# Altium project weather_station.PrjPcb
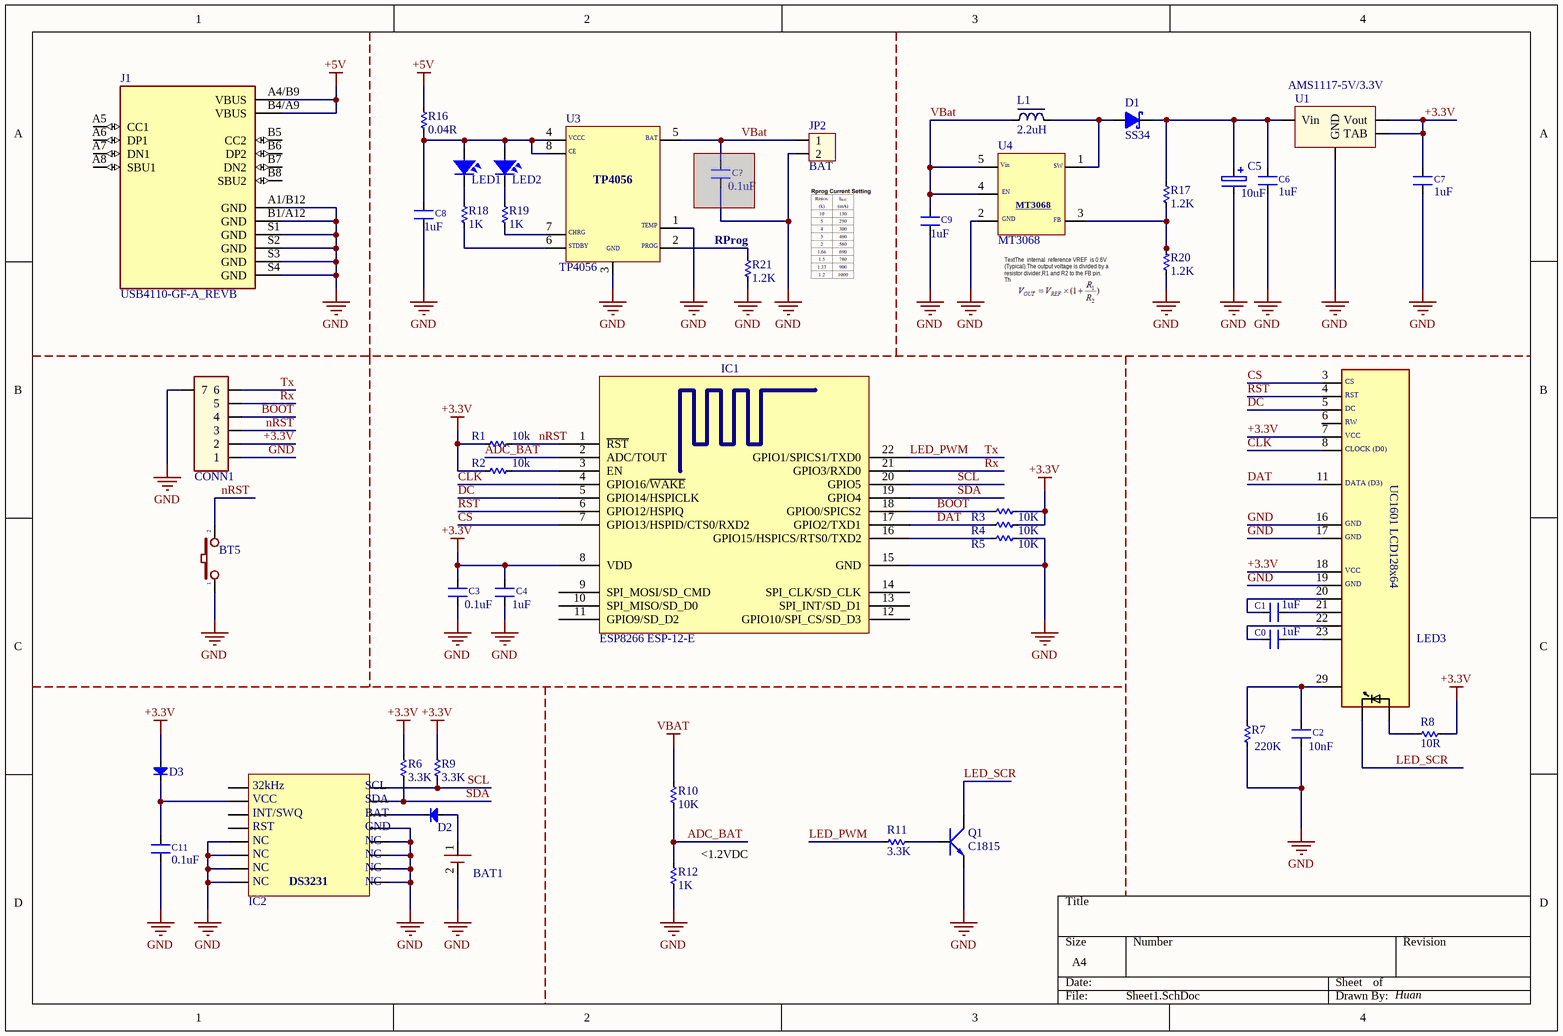
[diagram p0: Sheet1.SchDoc]
1 sheet, 48 parts. Net scope: global (net labels, ports and power ports of the same name join across sheets).
Board files: PCB1.PcbDoc, Rev1.1.PcbDoc

## Sheet Sheet1.SchDoc
size A4; SheetNumber: 1; SheetTotal: 1

### Parts
BAT1  CR2032  [CR2032_SMD]  (value not drawn)
BT5  BUTTON1  [SW-SMD - 3x4x2]  (value not drawn)
C0  1uF  [CN-SMD-0805]
C1  1uF  [CN-SMD-0805]
C2  10nF  [CN-SMD-0805]
C3  0.1uF  [CN-SMD-0805]
C4  1uF  [CN-SMD-0805]
C5  10uF  [cap_A_SMD 10uF/16V]
C6  1uF  [CN-SMD-0805]
C7  1uF  [CN-SMD-0805]
C8  1uF  [CN-SMD-0805]
C9  1uF  [CN-SMD-0805]
C11  0.1uF  [CN-SMD-0805]
C?  0.1uF  [CN-SMD-0805]  (masked out: inside a compile mask, not in the netlist)
CONN1  CONNECTOR 6P  [JST-PH2.0_6P]  (value not drawn)
D1  SS34  [DO-214AC(SMA)]
D2  (no value)  [SOD123]
D3  (no value)  [SOD123]
IC1  ESP8266 ESP-12-E  [ESP8266 ESP-12-E]
IC2  DS3231  [SO-16]  (value not drawn)
J1  USB4110-GF-A_REVB  [GCT_USB4105-GF-A]
JP2  BAT  [CON2]
L1  2.2uH  [L-SMD-06030-7.4x6.6X3]
LED1  GREEN  [SM-LED-0805-Green]  (value not drawn)
LED2  RED  [SM-LED-0805-Red]  (value not drawn)
LED3  UC1601_12864  [UC1601_LCD]  (value not drawn)
Q1  C1815  [SOT23B]
R1  10k  [RES-SMD-0805]
R2  10k  [RES-SMD-0805]
R3  10K  [RES-SMD-0805]
R4  10K  [RES-SMD-0805]
R5  10K  [RES-SMD-0805]
R6  3.3K  [RES-SMD-0805]
R7  220K  [RES-SMD-0805]
R8  10R  [RES-SMD-0805]
R9  3.3K  [RES-SMD-0805]
R10  10K  [RES-SMD-0805]
R11  3.3K  [RES-SMD-0805]
R12  1K  [RES-SMD-0805]
R16  0.04R  [RES-SMD-1206]
R17  1.2K  [RES-SMD-0805]
R18  1K  [RES-SMD-0805]
R19  1K  [RES-SMD-0805]
R20  1.2K  [RES-SMD-0805]
R21  1.2K  [RES-SMD-0805]
U1  AMS1117-5V/3.3V  [SOT-223]
U3  TP4056  [SOP-8]
U4  MT3068  [SOT23-6]

### Nets
+3.3V: C3.2 C4.2 C7.2 CONN1.2 D3.A IC1.8(VDD) LED3.7 LED3.18 R1.2 R2.2 R3.1 R4.1 R6.1 R8.1 R9.1 U1.2(Vout)
+5V: J1.A4/B9(VBUS) J1.B4/A9(VBUS) R16.1
GND: BAT1.2(GND) BT5.1 C2.1 C3.1 C4.1 C5.2 C6.1 C7.1 C8.1 C9.1 C11.1 CONN1.1 CONN1.7 IC1.15(GND) IC2.5 IC2.6 IC2.7 IC2.8 IC2.9 IC2.10 IC2.11 IC2.12 IC2.13 J1.A1/B12(GND) J1.B1/A12(GND) J1.S1(GND) J1.S2(GND) J1.S3(GND) J1.S4(GND) JP2.2 LED3.16 LED3.17 LED3.19 Q1.1(E) R5.1 R7.2 R12.2 R20.2 R21.2 U1.1(GND) U3.1 U3.3 U4.2
VBat: C9.2 JP2.1 L1.1 R10.1 U3.5 U4.4 U4.5
ADC_BAT: IC1.2(ADC/TOUT) R10.2 R12.1
BOOT: CONN1.4 IC1.18(GPIO0/SPICS2) R3.2
CLK: IC1.4(GPIO16/~{WAKE}) LED3.8
CS: IC1.7(GPIO13/HSPID/CTS0/RXD2) LED3.3
DAT: IC1.17(GPIO2/TXD1) LED3.11 R4.2
DC: IC1.5(GPIO14/HSPICLK) LED3.5
LED_PWM: CONN1.6 IC1.22(GPIO1/SPICS1/TXD0) R11.1  [also labelled Tx]
LED_SCR: LED3.K Q1.2(C)
nRST: BT5.2 CONN1.3 IC1.1(~{RST}) R1.1
RST: IC1.6(GPIO12/HSPIQ) LED3.4
Rx: CONN1.5 IC1.21(GPIO3/RXD0)
SCL: IC1.20(GPIO5) IC2.16 R9.2
SDA: IC1.19(GPIO4) IC2.15 R6.2
NetBAT1_1: BAT1.1(vcc) D2.A
NetC0_1: C0.1 LED3.22
NetC0_2: C0.2 LED3.23
NetC1_1: C1.1 LED3.20
NetC1_2: C1.2 LED3.21
NetC2_2: C2.2 LED3.29 R7.1
NetC5_1: C5.1 C6.2 D1.K R17.1 U1.3(Vin)
NetC8_2: C8.2 LED1.1 LED2.1 R16.2 U3.4 U3.8
NetC11_2: C11.2 D3.K IC2.2
NetD1_A: D1.A L1.2 U4.1
NetD2_K: D2.K IC2.14
NetIC1_3: IC1.3(EN) R2.1
NetIC1_16: IC1.16(GPIO15/HSPICS/RTS0/TXD2) R5.2
NetLED1_2: LED1.2 R18.1
NetLED2_2: LED2.2 R19.1
NetLED3_A: LED3.A R8.2
NetQ1_3: Q1.3(B) R11.2
NetR17_2: R17.2 R20.1 U4.3
NetR18_2: R18.2 U3.6
NetR19_2: R19.2 U3.7
NetR21_1: R21.1 U3.2

Not connected (* = marked no-connect by the designer): IC1 9(SPI_MOSI/SD_CMD) 10(SPI_MISO/SD_D0) 11(GPIO9/SD_D2) 12(GPIO10/SPI_CS/SD_D3) 13(SPI_INT/SD_D1) 14(SPI_CLK/SD_CLK); IC2 1 3 4; J1 A5(CC1) A6(DP1) A7(DN1) A8(SBU1) B5(CC2) B6(DP2) B7(DN2) B8(SBU2); LED3 6

### Notes on the sheet
- (near R21) RProg
- TextThe  internal  reference VREF  is 0.6V  (Typical).The output voltage is divided by a resistor divider,R1 and R2 to the FB pin. The output voltage is given by
- (near R12) <1.2VDC
- Huan
- (in symbol DS3231) 32kHz; SCL; VCC; SDA; INT/SWQ; BAT; RST; GND; NC
- (in symbol MT3068) Vin; SW; EN; GND; FB
- (in symbol TP4056) VCCC; BAT; CE; TEMP; CHRG; STDBY; PROG; GND
- (in symbol UC1601_12864) CS; RST; DC; RW; VCC; CLOCK (D0); UC1601 LCD128x64; DATA (D3); GND

### Library data of the parts
BT5 = BUTTON1: Value: 1N4007
C0-C4 C6-C9 C11 C? = CAP SMD: Value: 0,1uF/300V; Designed by: VanDungEvn
C5 = CAP_Radial1
D1 = Diode  Schottky: pin to pad: A>1 K>2; Value: 1N4007
D2 D3 = Diode-1N4007 -A4: Default Diode; Code - JEDEC: DO-214-AB; Value: 1N5007; Published: 8-Jun-2000; Revision: July-2002: Re-released for DXP Platform.; Publisher: Altium Limited
J1 = USB4110-GF-A_REVB: USB-C (USB TYPE-C) USB 2.0 Receptacle Connector 24 (16+8 Dummy) Position Surface Mount, Right Angle; Through Hole; MF: GCT; Value: *; Price: None; Package: None; SnapEDA_Link: https://www.snapeda.com/parts/USB4110-GF-A/Global%20Connector%20Technology/view-part/4001167/?ref=snap; Availability: Warning; MP: USB4110-GF-A; Purchase-URL: https://pricing.snapeda.com/search/part/USB4110-GF-A/?ref=eda; Check_prices: https://www.snapeda.com/parts/USB4110-GF-A/Global%20Connector%20Technology/view-part/4001167/?ref=eda
JP2 = Con2: Connector 2; Value: Connector 2
L1 = inductor-SMD: Value: 150 mH
LED1 LED2 = LED-SMD-0805
Q1 = C1815: NPN 600mW, ECB,; pin to pad: 1>2 2>3 3>1; Value: C1815
R1-R12 R16-R21 = Res-SMD: Resistor; Manufacturer: Generic Components; Class: Passive; Published: 08/06/2000; Publisher: Altium Hobart Technology Centre
U1 = AMS1117-5V/3.3V: IC on ap 5V/3.3V